# Altium schematic sheet SH4 - MICROCONTROLLER.SchDoc: MICROCONTROLLER
size 279 x 215 mm; CheckedBy: Lance Bantoto; Engineer: Taylor McNabb; Revision: 1; SheetNumber: 4; SheetTotal: 4
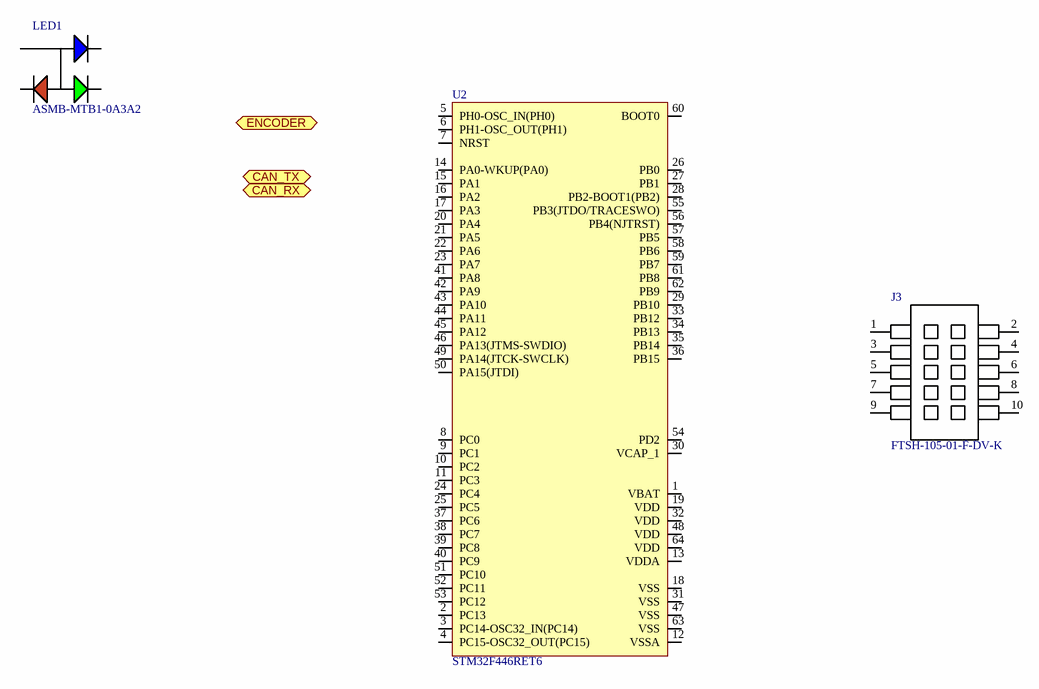
[diagram p0: SH4 - MICROCONTROLLER.SchDoc]

## Parts
J3  Manufacturer Part Number 1: FTSH-105-01-F-DV-K  [FTSH-105-01-F-DV-K-P-TR]  (hidden comment: CON_PROGRAMMING)
LED1  Manufacturer Part Number 1: ASMB-MTB1-0A3A2  [LED_RGB]  (hidden comment: LED_RGB)
U2  STM32F446RET6  [STM_LQFP64_N]

## Ports
CAN_RX (bidir), CAN_TX (bidir), ENCODER (bidir)

## Nets

Not connected (* = marked no-connect by the designer): J3 1 2 3 4 5 6 7 8 9 10; LED1 1(CATHODE_(RED)) 2(CATHODE_(GREEN)) 3(CATHODE_(BLUE)) 4(COMMON_ANODE); U2 1(VBAT) 2(PC13) 3(PC14-OSC32_IN(PC14)) 4(PC15-OSC32_OUT(PC15)) 5(PH0-OSC_IN(PH0)) 6(PH1-OSC_OUT(PH1)) 7(NRST) 8(PC0) 9(PC1) 10(PC2) 11(PC3) 12(VSSA) 13(VDDA) 14(PA0-WKUP(PA0)) 15(PA1) 16(PA2) 17(PA3) 18(VSS) 19(VDD) 20(PA4) 21(PA5) 22(PA6) 23(PA7) 24(PC4) 25(PC5) 26(PB0) 27(PB1) 28(PB2-BOOT1(PB2)) 29(PB10) 30(VCAP_1) 31(VSS) 32(VDD) 33(PB12) 34(PB13) 35(PB14) 36(PB15) 37(PC6) 38(PC7) 39(PC8) 40(PC9) 41(PA8) 42(PA9) 43(PA10) 44(PA11) 45(PA12) 46(PA13(JTMS-SWDIO)) 47(VSS) 48(VDD) 49(PA14(JTCK-SWCLK)) 50(PA15(JTDI)) 51(PC10) 52(PC11) 53(PC12) 54(PD2) 55(PB3(JTDO/TRACESWO)) 56(PB4(NJTRST)) 57(PB5) 58(PB6) 59(PB7) 60(BOOT0) 61(PB8) 62(PB9) 63(VSS) 64(VDD)

## Notes on the sheet
- University of Waterloo Robotics Team
- 200 University Ave W
- REV
- PROJECT
- Waterloo, Ontario, Canada
- N2L 3G1
- DOCUMENT
- ENGINEER
- REVIEWER
- MODIFIED
- SHEET
- OF

## Library data of the parts
J3 = CON_PROGRAMMING: CONN HEADER SMD 10POS 1.27MM; Manufacturer 1: Samtec; Supplier 1: Digi-Key; Mounting Type: SMD; Pitch: 1.27mm; Supplier Part Number 1: SAM8796-ND
LED1 = LED_RGB: LED RGB DIFFUSED 4PLCC SMD; Manufacturer 1: Broadcom; Color: Blue,Green,Red; Lens Color: White; Viewing Angle: 115°; Lens Style: Round; Luminous Intensity: 350mcd; Dominant Wavelength: 470nm; Forward Voltage: 3.1V; Test Current: 20mA; Package/Footprint: 4-PLCC; Supplier 1: Digi-Key; Mounting Type: SMD; Number of Pins: 4; Lens Transparency: Diffused; Supplier Part Number 1: 516-3280-1-ND
U2 = STM32F446RET6: IC MCU 32BIT 512KB FLASH 64LQFP; Manufacturer 1: STMicroelectronics; Manufacturer Part Number 1: LF80CDT-TR; Supplier 1: Digi-Key; Supplier Part Number 1: 497-15376-ND